# Altium schematic sheet Sheet1.SchDoc
size A4
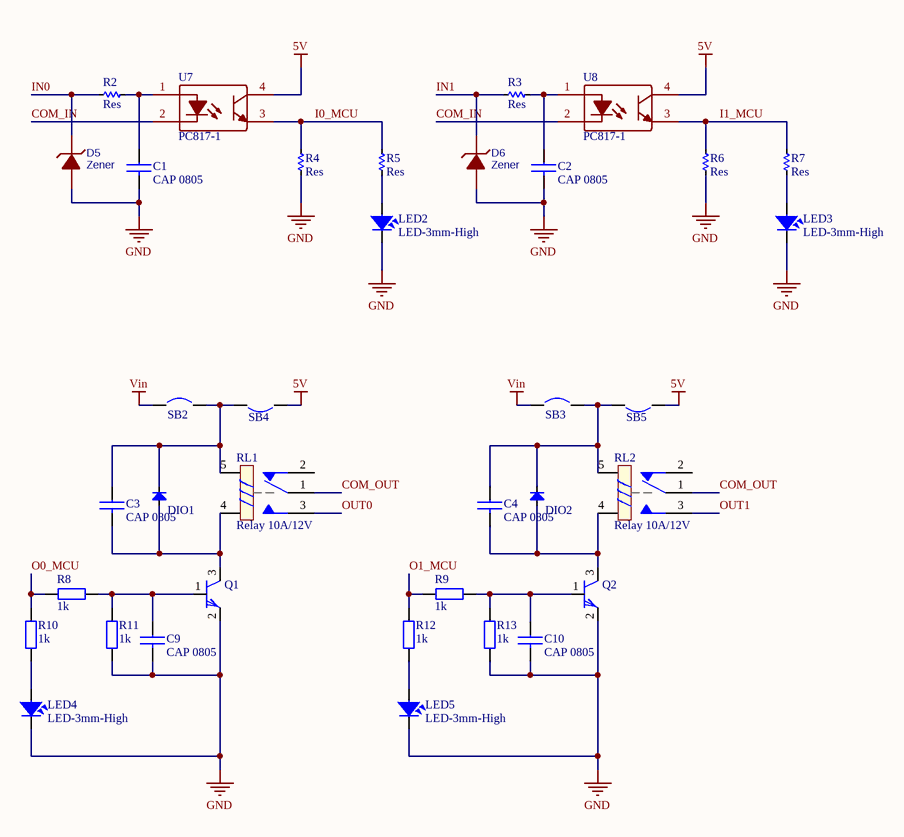
[diagram p0: Sheet1.SchDoc]

## Parts
C1  CAP 0805  [0805]
C2  CAP 0805  [0805]
C3  CAP 0805  [0805]
C4  CAP 0805  [0805]
C9  CAP 0805  [0805]
C10  CAP 0805  [0805]
D5  Zener  [SOD80C]
D6  Zener  [SOD80C]
DIO1  Diode SMD  [DIO-SMD-106]  (value not drawn)
DIO2  Diode SMD  [DIO-SMD-106]  (value not drawn)
LED2  LED-3mm-High  [LED-3mm-High-Blue]
LED3  LED-3mm-High  [LED-3mm-High-Blue]
LED4  LED-3mm-High  [LED-3mm-High-Blue]
LED5  LED-3mm-High  [LED-3mm-High-Blue]
Q1  C1815  [SOT23 [C1815]]  (value not drawn)
Q2  C1815  [SOT23 [C1815]]  (value not drawn)
R2  Res  [RES-SMD-0805]
R3  Res  [RES-SMD-0805]
R4  Res  [RES-SMD-0805]
R5  Res  [RES-SMD-0805]
R6  Res  [RES-SMD-0805]
R7  Res  [RES-SMD-0805]
R8  1k  [SM-RES-0805]
R9  1k  [SM-RES-0805]
R10  1k  [SM-RES-0805]
R11  1k  [SM-RES-0805]
R12  1k  [SM-RES-0805]
R13  1k  [SM-RES-0805]
RL1  Relay 10A/12V  [RELAY 5]
RL2  Relay 10A/12V  [RELAY 5]
SB2  Circuit-Shorter  [Circuit-Shorter]  (value not drawn)
SB3  Circuit-Shorter  [Circuit-Shorter]  (value not drawn)
SB4  Circuit-Shorter  [Circuit-Shorter]  (value not drawn)
SB5  Circuit-Shorter  [Circuit-Shorter]  (value not drawn)
U7  PC817-1  [PC817-1-SMD]
U8  PC817-1  [PC817-1-SMD]

## Nets
5V: SB4.1 SB5.1 U7.4(COL) U8.4(COL)
GND: C1.2 C2.2 C9.2 C10.2 D5.1(A) D6.1(A) LED2.2(K) LED3.2(K) LED4.2(K) LED5.2(K) Q1.2(E) Q2.2(E) R4.1 R6.1 R11.2 R13.2
Vin: SB2.1 SB3.1
COM_IN: U7.2(CA) U8.2(CA)
COM_OUT: RL1.1 RL2.1
I0_MCU: R4.2 R5.1 U7.3(EM)
I1_MCU: R6.2 R7.1 U8.3(EM)
IN0: D5.2(K) R2.2
IN1: D6.2(K) R3.2
O0_MCU: R8.2 R10.2
O1_MCU: R9.2 R12.2
OUT0: RL1.3
OUT1: RL2.3
NetC1_1: C1.1 R2.1 U7.1(AN)
NetC2_1: C2.1 R3.1 U8.1(AN)
NetC3_1: C3.1 DIO1.2(K) RL1.5 SB2.2 SB4.2
NetC3_2: C3.2 DIO1.1(A) Q1.3(C) RL1.4
NetC4_1: C4.1 DIO2.2(K) RL2.5 SB3.2 SB5.2
NetC4_2: C4.2 DIO2.1(A) Q2.3(C) RL2.4
NetC9_1: C9.1 Q1.1(B) R8.1 R11.1
NetC10_1: C10.1 Q2.1(B) R9.1 R13.1
NetLED2_1: LED2.1(A) R5.2
NetLED3_1: LED3.1(A) R7.2
NetLED4_1: LED4.1(A) R10.1
NetLED5_1: LED5.1(A) R12.1

Not connected (* = marked no-connect by the designer): RL1 2; RL2 2

## Library data of the parts
C1-C4 C9 C10 = CAP 0805: Right: 20; Bottom: 10
D5 D6 = Zener: BOM_Manufacturer: NXP Semicon; BOM_Manufacturer Part: BZV55-C15; Contributor: LCSC; BOM_Supplier: LCSC; BOM_Supplier Part: C108433; spicePre: D
DIO1 DIO2 = Diode SMD: Default Diode; Code - JEDEC: DO-214-AB; Value: 1N5007; Published: 8-Jun-2000; Revision: July-2002: Re-released for DXP Platform.; Publisher: Altium Limited
Q1 Q2 = C1815: Q2SC1815; PSpiceTemplate: Q^@REFDES %c %b %e @MODEL; Vendor: Digikey; COMPONENT: 2SC1815; Published: 13-April-2009; Publisher: Hoang Nguyen; ComponentLink1Description: Digikey Part Link; ComponentLink2Description: Open Datasheet; ComponentLink2URL: H:\LIBRARY\LIBRARY.Datasheet\; Price: 500VND
R2-R7 = Res-SMD: Resistor; Manufacturer: Generic Components; Class: Passive; Published: 08/06/2000; Publisher: Altium Hobart Technology Centre
R8-R13 = R1/4W: Resistor 1/4W; Value: R1/4W - 1K
RL1 RL2 = Relay 5: Relay SPDT,10A - 12VDC 5 Pin; Value: Relay SPDT, 10A, 12V
SB2-SB5 = Circuit-Shorter: Solder: NO; Published: 24-Mar-1999; Revision: July-2002: Re-released for DXP Platform.; Publisher: Altium Limited